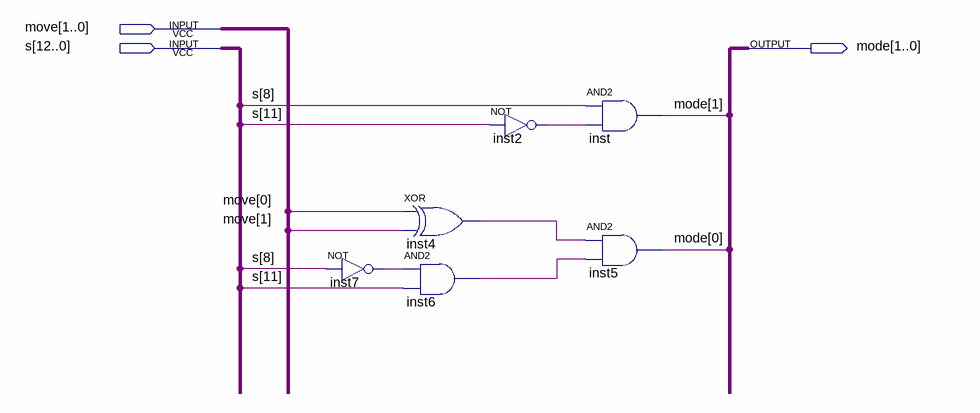
[diagram p0: schematic sheet]
// Quartus schematic CursorMode.bdf as structural Verilog: 6 symbols, 3 pins
module CursorMode (
  input  [1:0] move,
  input  [12:0] s,
  output [1:0] mode
);

  wire inst2_out, inst4_out, inst6_out, inst7_out;

  not inst7 (inst7_out, s[8]);
  xor inst4 (inst4_out, move[0], move[1]);
  and inst6 (inst6_out, inst7_out, s[11]);
  not inst2 (inst2_out, s[11]);
  and inst (mode[1], s[8], inst2_out);
  and inst5 (mode[0], inst4_out, inst6_out);
endmodule
